# Altium schematic sheet EthernetRMIIPHY.SchDoc
size A4
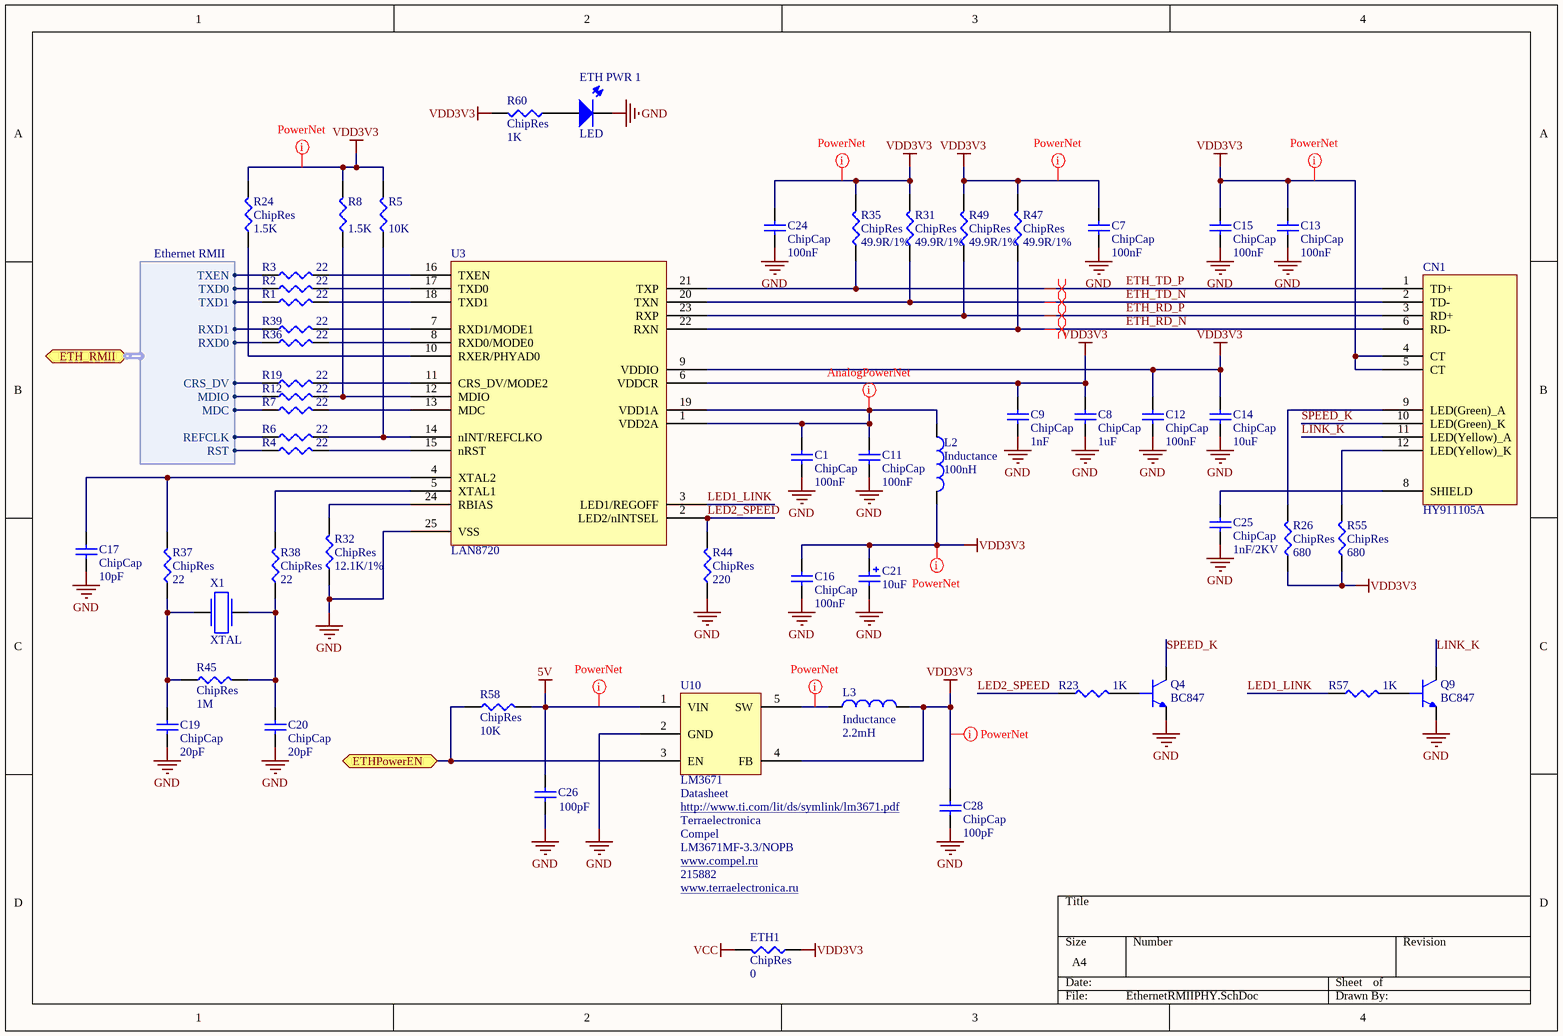
[diagram p0: EthernetRMIIPHY.SchDoc]

## Parts
C1  ChipCap  value 100nF  [CAP0805]
C7  ChipCap  value 100nF  [CAP0805]
C8  ChipCap  value 1uF  [CAP0805]
C9  ChipCap  value 1nF  [CAP0805]
C11  ChipCap  value 100nF  [CAP0805]
C12  ChipCap  value 100nF  [CAP0805]
C13  ChipCap  value 100nF  [CAP0805]
C14  ChipCap  value 10uF  [CAP0805]
C15  ChipCap  value 100nF  [CAP0805]
C16  ChipCap  value 100nF  [CAP0805]
C17  ChipCap  value 10pF  [CAP0805]
C19  ChipCap  value 20pF  [CAP0805]
C20  ChipCap  value 20pF  [CAP0805]
C21  value 10uF  [CAPC7343]  (hidden comment: Cap Pol SMD)
C24  ChipCap  value 100nF  [CAP0805]
C25  ChipCap  value 1nF/2KV  [CAP0805]
C26  value 100pF  [CAP1210]  (hidden comment: ChipCap)
C28  ChipCap  value 100pF  [CAP1210]
CN1  HY911105A  [HR911105A]
ETH1  ChipRes  value 0  [RES0805]
ETH_PWR_1  LED  [PLCC-2]
L2  Inductance  value 100nH  [CM45]
L3  Inductance  value 2.2mH  [CDRH2D14]
Q4  BC847  [SOT23]
Q9  BC847  [SOT23]
R1  value 22  [RES0805]  (hidden comment: ChipRes)
R2  value 22  [RES0805]  (hidden comment: ChipRes)
R3  value 22  [RES0805]  (hidden comment: ChipRes)
R4  value 22  [RES0805]  (hidden comment: ChipRes)
R5  value 10K  [RES0805]  (hidden comment: ChipRes)
R6  value 22  [RES0805]  (hidden comment: ChipRes)
R7  value 22  [RES0805]  (hidden comment: ChipRes)
R8  value 1.5K  [RES0805]  (hidden comment: ChipRes)
R12  value 22  [RES0805]  (hidden comment: ChipRes)
R19  value 22  [RES0805]  (hidden comment: ChipRes)
R23  value 1K  [RES0805]  (hidden comment: ChipRes)
R24  ChipRes  value 1.5K  [RES0805]
R26  ChipRes  value 680  [RES0805]
R31  ChipRes  value 49.9R/1%  [RES0805]
R32  ChipRes  value 12.1K/1%  [RES0805]
R35  ChipRes  value 49.9R/1%  [RES0805]
R36  value 22  [RES0805]  (hidden comment: ChipRes)
R37  ChipRes  value 22  [RES0805]
R38  ChipRes  value 22  [RES0805]
R39  value 22  [RES0805]  (hidden comment: ChipRes)
R44  ChipRes  value 220  [RES0805]
R45  ChipRes  value 1M  [RES0805]
R47  ChipRes  value 49.9R/1%  [RES0805]
R49  ChipRes  value 49.9R/1%  [RES0805]
R55  ChipRes  value 680  [RES0805]
R57  value 1K  [RES0805]  (hidden comment: ChipRes)
R58  ChipRes  value 10K  [RES0805]
R60  ChipRes  value 1K  [RES0805]
U3  LAN8720  [QFN50P375X375X85_HS-25N]
U10  LM3671  ComponentLink1Description: Datasheet  Supplier 1: Terraelectronica  Supplier 2: Compel  Supplier Part Number 2: LM3671MF-3.3/NOPB  Supplier Part Number 1: 215882  [SOT23-5]
X1  XTAL  [BCY-W2/E4.7]

## Ports
ETH_RMII (harness Ethernet RMII), ETHPowerEN

## Harnesses
Ethernet RMII: MDIO, MDC, RST, REFCLK, CRS_DV, TXEN, TXD0, TXD1, RXD0, RXD1

## Nets
5V: C26.2 R58.2 U10.1(VIN)
GND: C1.1 C7.1 C8.1 C9.1 C11.1 C12.1 C13.1 C14.1 C15.1 C16.1 C17.1 C19.1 C20.1 C21.2 C24.1 C25.1 C26.1 C28.1 ETH_PWR_1.1 Q4.2 Q9.2 R32.1 R44.1 U3.25(VSS) U10.2(GND)
VCC: ETH1.2
VDD3V3: C7.2 C8.2 C9.2 C12.2 C13.2 C14.2 C15.2 C16.2 C21.1 C24.2 C28.2 CN1.4(CT) CN1.5(CT) ETH1.1 L2.1 L3.1 R5.2 R8.2 R24.2 R26.1 R31.2 R35.2 R47.2 R49.2 R55.1 R60.2 U3.6(VDDCR) U3.9(VDDIO) U10.4(FB)
ETH_RD_N: CN1.6(RD-) R47.1 U3.22(RXN)
ETH_RD_P: CN1.3(RD+) R49.1 U3.23(RXP)
ETH_TD_N: CN1.2(TD-) R31.1 U3.20(TXN)
ETH_TD_P: CN1.1(TD+) R35.1 U3.21(TXP)
ETHPowerEN: R58.1 U10.3(EN) ; port ETHPowerEN
LED1_LINK: R57.1 U3.3(LED1/REGOFF)
LED2_SPEED: R23.1 R44.2 U3.2(LED2/nINTSEL)
LINK_K: CN1.11(LED(Yellow)_A) Q9.3
SPEED_K: CN1.10(LED(Green)_K) Q4.3
NetC1_2: C1.2 C11.2 L2.2 U3.1(VDD2A) U3.19(VDD1A)
NetC17_2: C17.2 R37.2 U3.4(XTAL2)
NetC19_2: C19.2 R37.1 R45.1 X1.1
NetC20_2: C20.2 R38.1 R45.2 X1.2
NetC25_2: C25.2 CN1.8(SHIELD)
NetCN1_9: CN1.9(LED(Green)_A) R26.2
NetCN1_12: CN1.12(LED(Yellow)_K) R55.2
NetETH_PWR_1_2: ETH_PWR_1.2 R60.1
NetL3_2: L3.2 U10.5(SW)
NetQ4_1: Q4.1 R23.2
NetQ9_1: Q9.1 R57.2
NetR1_1: R1.1 ; port ETH_RMII.TXD1
NetR1_2: R1.2 U3.18(TXD1)
NetR2_1: R2.1 ; port ETH_RMII.TXD0
NetR2_2: R2.2 U3.17(TXD0)
NetR3_1: R3.1 ; port ETH_RMII.TXEN
NetR3_2: R3.2 U3.16(TXEN)
NetR4_1: R4.1 ; port ETH_RMII.RST
NetR4_2: R4.2 U3.15(nRST)
NetR5_1: R5.1 R6.2 U3.14(nINT/REFCLKO)
NetR6_1: R6.1 ; port ETH_RMII.REFCLK
NetR7_1: R7.1 ; port ETH_RMII.MDC
NetR7_2: R7.2 U3.13(MDC)
NetR8_1: R8.1 R12.2 U3.12(MDIO)
NetR12_1: R12.1 ; port ETH_RMII.MDIO
NetR19_1: R19.1 ; port ETH_RMII.CRS_DV
NetR19_2: R19.2 U3.11(CRS_DV/MODE2)
NetR24_1: R24.1 U3.10(RXER/PHYAD0)
NetR32_2: R32.2 U3.24(RBIAS)
NetR36_1: R36.1 ; port ETH_RMII.RXD0
NetR36_2: R36.2 U3.8(RXD0/MODE0)
NetR38_2: R38.2 U3.5(XTAL1)
NetR39_1: R39.1 ; port ETH_RMII.RXD1
NetR39_2: R39.2 U3.7(RXD1/MODE1)

## Layout directives
differential pair: ETH_RD_N, ETH_RD_P, ETH_TD_N, ETH_TD_P
net class Undefined: 5V, NetL3_2, VDD3V3
net class AnalogPowerNet: NetC1_2

## Library data of the parts
C1 C7-C9 C11-C17 C19 C20 C24-C26 C28 = ChipCap: Capacitor; Published: 8-Jun-2000; LatestRevisionDate: 17-Jul-2002; LatestRevisionNote: Re-released for DXP Platform.; PackageReference: RAD-0.3; Publisher: Altium Limited
C21 = Cap Pol Chip: Polarized Capacitor (Radial); Supplier 1: Digi-Key; Supplier Part Number 1: 399-4029-1-ND
ETH1 R1-R8 R12 R19 R23 R24 R26 R31 R32 R35-R39 R44 R45 R47 R49 R55 R57 R58 R60 = ChipRes: Chip resistor
ETH_PWR_1 = LED0603
L2 L3 = ChipInductance
Q4 Q9 = BC847: NPN transistor
U3 = LAM8720: Small Footprint RMII 10/100 Ethernet  Transceiver
U10 = LM3671MF: 600-mA Step-Down DC-DC Converter; ComponentLink1URL: http://www.ti.com/lit/ds/symlink/lm3671.pdf; Supplier URL 2: www.compel.ru; Supplier URL 1: www.terraelectronica.ru
X1 = Crystall oscillator: Quartz crystall oscillator